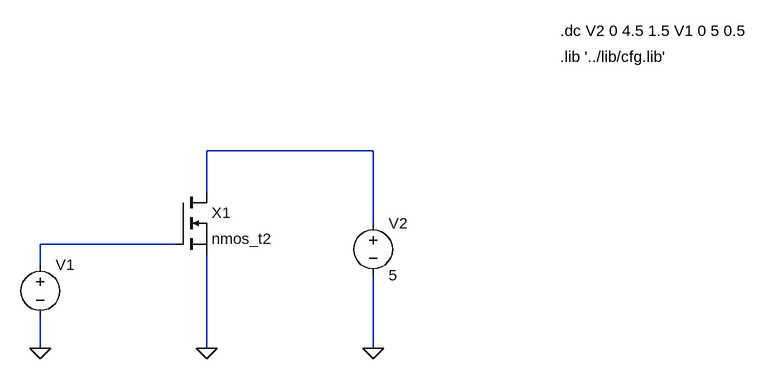
[diagram p0: schematic nmos-Ids-Vds.asc]
nmos-Ids-Vds.asc, the LTspice schematic file:
Version 4
SHEET 1 880 680
WIRE 208 32 -48 32
WIRE -48 96 -48 32
WIRE 208 144 208 32
WIRE -96 176 -304 176
WIRE -304 208 -304 176
WIRE -304 336 -304 288
WIRE -48 336 -48 192
WIRE 208 336 208 224
FLAG 208 336 0
FLAG -48 336 0
FLAG -304 336 0
SYMBOL nmos -96 96 R0
SYMATTR InstName X1
SYMATTR Value nmos_t2
SYMATTR Prefix X
SYMBOL voltage 208 128 R0
SYMATTR InstName V2
SYMATTR Value 5
SYMBOL voltage -304 192 R0
SYMATTR InstName V1
SYMATTR Value ""
TEXT 496 -112 Left 2 !.lib '../lib/cfg.lib'
TEXT 496 -152 Left 2 !.dc V2 0 4.5 1.5 V1 0 5 0.5

The netlist it stands for:
* nmos-Ids-Vds.asc
XX1 N001 N002 0 nmos_t2  ; pins D G S
V2 N001 0 5
V1 N002 0
.lib '../lib/cfg.lib'
.dc V2 0 4.5 1.5 V1 0 5 0.5
.backanno
.end